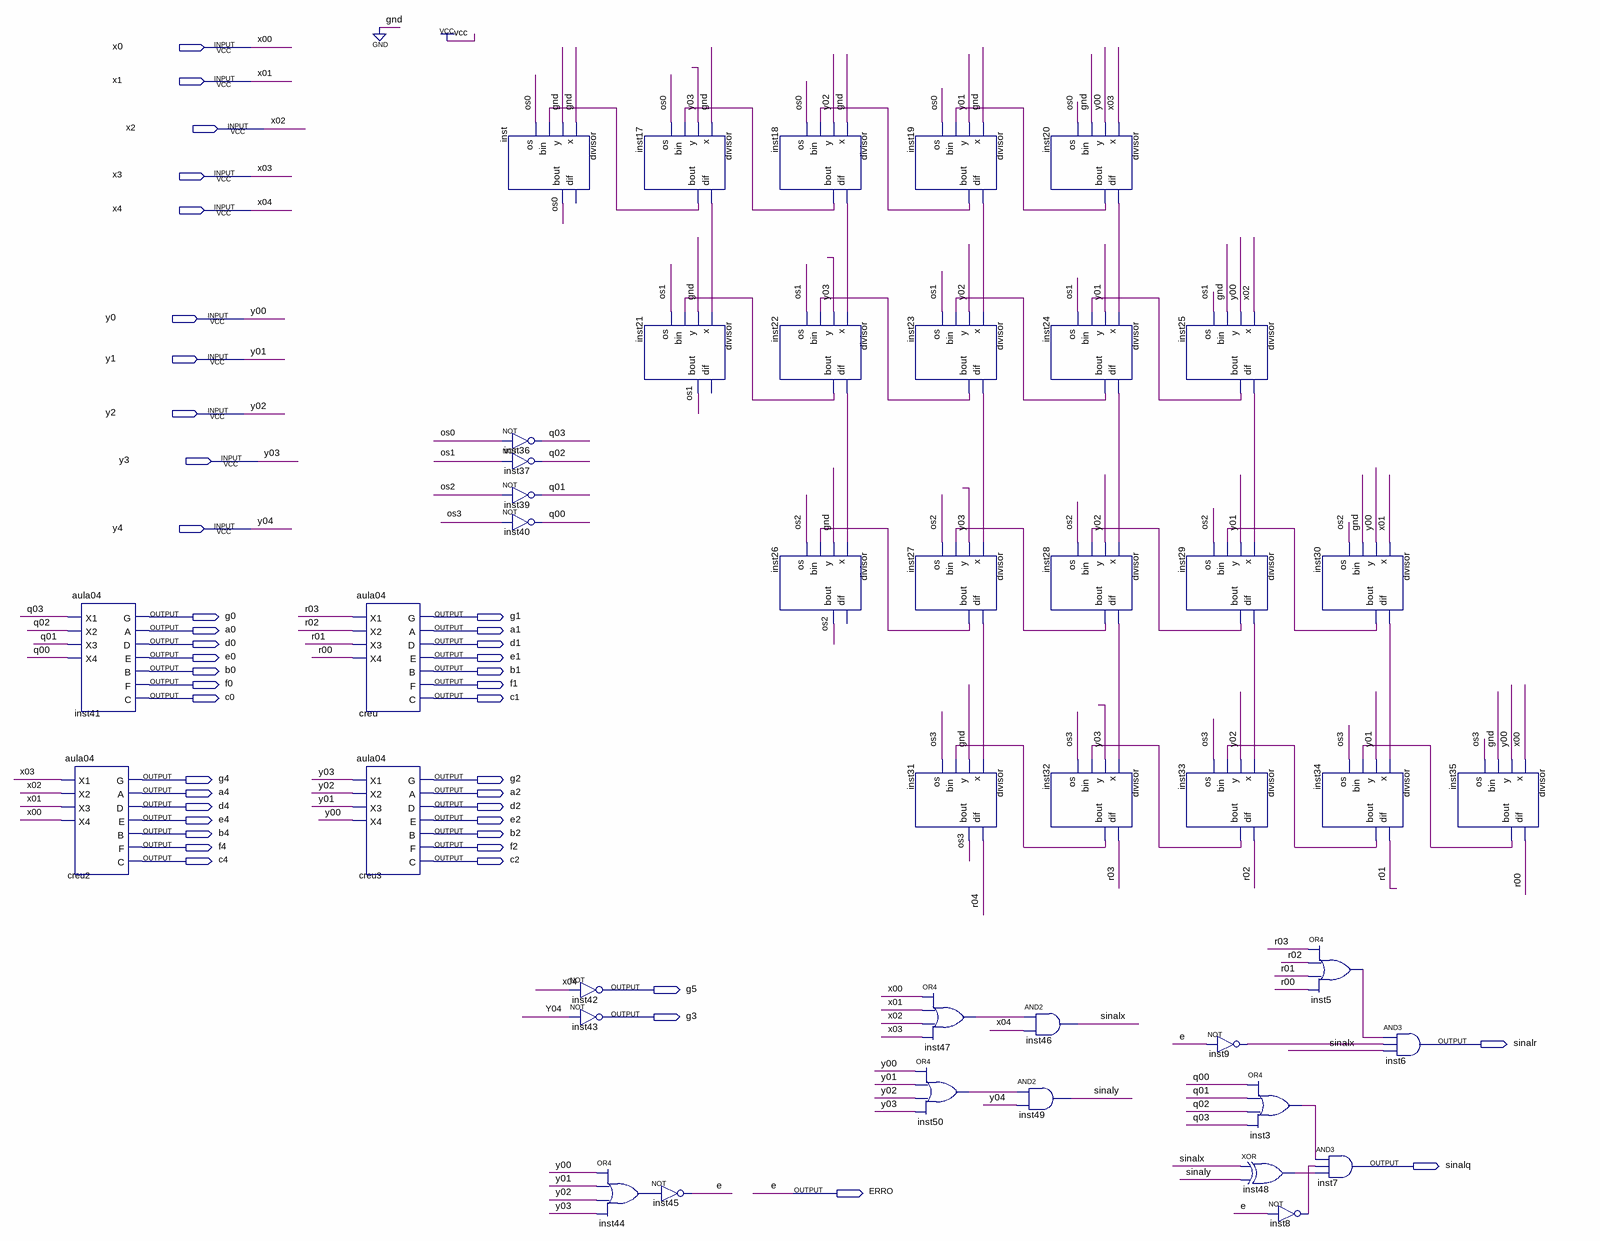
[diagram p0: schematic sheet]
// Quartus schematic aula11.bdf as structural Verilog: 43 symbols, 43 pins
module aula11 (
  input  x0,
  input  x1,
  input  x2,
  input  x3,
  input  x4,
  input  y0,
  input  y1,
  input  y2,
  input  y3,
  input  y4,
  output g0,
  output g1,
  output a0,
  output a1,
  output d0,
  output d1,
  output e0,
  output e1,
  output b0,
  output b1,
  output f0,
  output f1,
  output c0,
  output c1,
  output g4,
  output g2,
  output a4,
  output a2,
  output d4,
  output d2,
  output e4,
  output e2,
  output b4,
  output b2,
  output f4,
  output f2,
  output c4,
  output c2,
  output g5,
  output g3,
  output sinalr,
  output sinalq,
  output ERRO
);

  wire inst3_out, inst5_out, inst8_out, inst9_out, inst17_bout, inst17_dif, inst18_bout, inst18_dif,
       inst19_bout, inst19_dif, inst20_bout, inst20_dif, inst22_bout, inst22_dif, inst23_bout, inst23_dif,
       inst24_bout, inst24_dif, inst25_bout, inst25_dif, inst27_bout, inst27_dif, inst28_bout, inst28_dif,
       inst29_bout, inst29_dif, inst30_bout, inst30_dif, inst32_bout, inst33_bout, inst34_bout, inst35_bout,
       inst44_out, inst47_out, inst48_out, inst50_out, os0, os1, os2, os3, q00, q01, q02, q03, r00, r01, r02,
       r03, r04, sinalx, sinaly;

  aula04 inst41 (.X1(q03), .X2(q02), .X3(q01), .X4(q00), .G(g0), .A(a0), .D(d0), .E(e0), .B(b0), .F(f0), .C(c0));
  aula04 creu2 (.X1(x3), .X2(x2), .X3(x1), .X4(x0), .G(g4), .A(a4), .D(d4), .E(e4), .B(b4), .F(f4), .C(c4));
  aula04 creu (.X1(r03), .X2(r02), .X3(r01), .X4(r00), .G(g1), .A(a1), .D(d1), .E(e1), .B(b1), .F(f1), .C(c1));
  aula04 creu3 (.X1(y3), .X2(y2), .X3(y1), .X4(y0), .G(g2), .A(a2), .D(d2), .E(e2), .B(b2), .F(f2), .C(c2));
  divisor inst (.x(1'b0), .y(1'b0), .bin(inst17_bout), .os(os0), .bout(os0));  // open: dif
  not inst36 (q03, os0);
  not inst37 (q02, os1);
  not inst39 (q01, os2);
  not inst40 (q00, os3);
  not inst42 (g5, x4);
  not inst43 (g3, y4);
  or inst44 (inst44_out, y0, y1, y2, y3);
  divisor inst17 (.x(1'b0), .y(y3), .bin(inst18_bout), .os(os0), .dif(inst17_dif), .bout(inst17_bout));
  divisor inst21 (.x(inst17_dif), .y(1'b0), .bin(inst22_bout), .os(os1), .bout(os1));  // open: dif
  not inst45 (ERRO, inst44_out);
  divisor inst18 (.x(1'b0), .y(y2), .bin(inst19_bout), .os(os0), .dif(inst18_dif), .bout(inst18_bout));
  divisor inst22 (.x(inst18_dif), .y(y3), .bin(inst23_bout), .os(os1), .dif(inst22_dif), .bout(inst22_bout));
  divisor inst26 (.x(inst22_dif), .y(1'b0), .bin(inst27_bout), .os(os2), .bout(os2));  // open: dif
  divisor inst19 (.x(1'b0), .y(y1), .bin(inst20_bout), .os(os0), .dif(inst19_dif), .bout(inst19_bout));
  divisor inst23 (.x(inst19_dif), .y(y2), .bin(inst24_bout), .os(os1), .dif(inst23_dif), .bout(inst23_bout));
  divisor inst27 (.x(inst23_dif), .y(y3), .bin(inst28_bout), .os(os2), .dif(inst27_dif), .bout(inst27_bout));
  divisor inst31 (.x(inst27_dif), .y(1'b0), .bin(inst32_bout), .os(os3), .dif(r04), .bout(os3));
  or inst47 (inst47_out, x0, x1, x2, x3);
  or inst50 (inst50_out, y0, y1, y2, y3);
  divisor inst20 (.x(x3), .y(y0), .bin(1'b0), .os(os0), .dif(inst20_dif), .bout(inst20_bout));
  divisor inst24 (.x(inst20_dif), .y(y1), .bin(inst25_bout), .os(os1), .dif(inst24_dif), .bout(inst24_bout));
  divisor inst28 (.x(inst24_dif), .y(y2), .bin(inst29_bout), .os(os2), .dif(inst28_dif), .bout(inst28_bout));
  divisor inst32 (.x(inst28_dif), .y(y3), .bin(inst33_bout), .os(os3), .dif(r03), .bout(inst32_bout));
  and inst46 (sinalx, inst47_out, x4);
  and inst49 (sinaly, inst50_out, y4);
  divisor inst25 (.x(x2), .y(y0), .bin(1'b0), .os(os1), .dif(inst25_dif), .bout(inst25_bout));
  divisor inst29 (.x(inst25_dif), .y(y1), .bin(inst30_bout), .os(os2), .dif(inst29_dif), .bout(inst29_bout));
  divisor inst33 (.x(inst29_dif), .y(y2), .bin(inst34_bout), .os(os3), .dif(r02), .bout(inst33_bout));
  not inst9 (inst9_out, ERRO);
  or inst3 (inst3_out, q00, q01, q02, q03);
  xor inst48 (inst48_out, sinalx, sinaly);
  divisor inst30 (.x(x1), .y(y0), .bin(1'b0), .os(os2), .dif(inst30_dif), .bout(inst30_bout));
  divisor inst34 (.x(inst30_dif), .y(y1), .bin(inst35_bout), .os(os3), .dif(r01), .bout(inst34_bout));
  or inst5 (inst5_out, r03, r02, r01, r00);
  and inst7 (sinalq, inst3_out, inst8_out, inst48_out);
  not inst8 (inst8_out, ERRO);
  and inst6 (sinalr, inst5_out, inst9_out, sinalx);
  divisor inst35 (.x(x0), .y(y0), .bin(1'b0), .os(os3), .dif(r00), .bout(inst35_bout));

  // Other names for the same wires on the sheet: e = ERRO; x00 = x0; x01 = x1; x02 = x2; x03 = x3; x04 = x4; y00 = y0;
  //   y01 = y1; y02 = y2; y03 = y3; y04 = y4
endmodule
